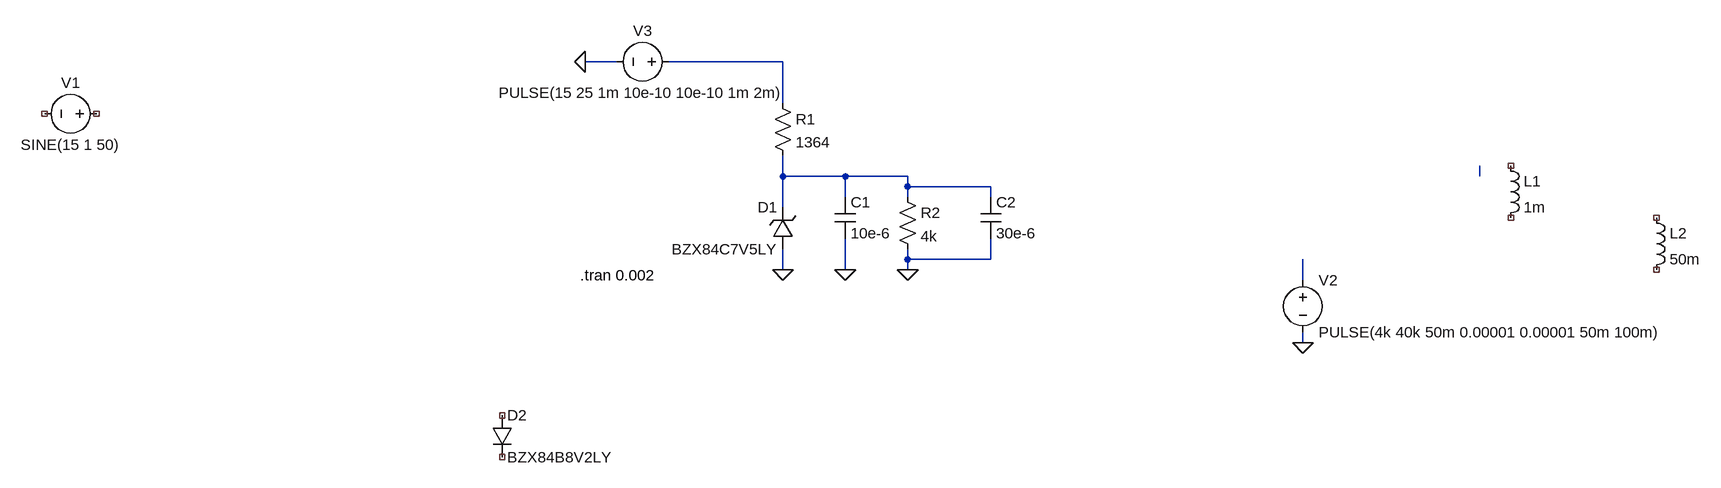
[diagram p0: schematic Draft3.asc]
Draft3.asc, the LTspice schematic file:
Version 4.1
SHEET 1 1660 688
WIRE -16 64 -64 64
WIRE 240 64 64 64
WIRE 240 128 240 64
WIRE 240 240 240 208
WIRE 336 240 240 240
WIRE 432 240 336 240
WIRE 1312 240 1312 224
WIRE 432 256 432 240
WIRE 560 256 432 256
WIRE 336 272 336 240
WIRE 432 272 432 256
WIRE 560 272 560 256
WIRE 240 288 240 240
WIRE 432 368 432 352
WIRE 560 368 560 336
WIRE 560 368 432 368
WIRE 240 384 240 352
WIRE 336 384 336 336
WIRE 432 384 432 368
WIRE 1040 400 1040 368
WIRE 1040 496 1040 480
FLAG 240 384 0
FLAG 336 384 0
FLAG -64 64 0
FLAG 1040 496 0
FLAG 432 384 0
SYMBOL voltage -800 144 R90
WINDOW 0 -32 56 VBottom 2
WINDOW 3 32 56 VTop 2
SYMATTR InstName V1
SYMATTR Value SINE(15 1 50)
SYMBOL res 224 112 R0
SYMATTR InstName R1
SYMATTR Value 1364
SYMBOL res 416 256 R0
SYMATTR InstName R2
SYMATTR Value 4k
SYMBOL cap 320 272 R0
SYMATTR InstName C1
SYMATTR Value 10e-6
SYMBOL zener 256 352 R180
WINDOW 0 24 64 Left 2
WINDOW 3 24 0 Left 2
SYMATTR InstName D1
SYMATTR Value BZX84C7V5LY
SYMBOL voltage 1040 384 R0
SYMATTR InstName V2
SYMATTR Value PULSE(4k 40k 50m 0.00001 0.00001 50m 100m)
SYMBOL voltage 80 64 R90
WINDOW 0 -32 56 VBottom 2
WINDOW 3 32 56 VTop 2
SYMATTR InstName V3
SYMATTR Value PULSE(15 25 1m 10e-10 10e-10 1m 2m)
SYMBOL cap 544 272 R0
SYMATTR InstName C2
SYMATTR Value 30e-6
SYMBOL ind 1344 208 R0
SYMATTR InstName L1
SYMATTR Value 1m
SYMBOL diode -208 608 R0
SYMATTR InstName D2
SYMATTR Value BZX84B8V2LY
SYMBOL ind 1568 288 R0
SYMATTR InstName L2
SYMATTR Value 50m
TEXT -72 392 Left 2 !.tran 0.002

The netlist it stands for:
* Draft3.asc
V1 NC_01 NC_02 SINE(15 1 50)
R1 N001 N002 1364
R2 N002 0 4k
C1 N002 0 10e-6
D1 0 N002 BZX84C7V5LY
V2 N004 0 PULSE(4k 40k 50m 0.00001 0.00001 50m 100m)
V3 N001 0 PULSE(15 25 1m 10e-10 10e-10 1m 2m)
C2 N002 0 30e-6
L1 NC_03 NC_04 1m
D2 NC_05 NC_06 BZX84B8V2LY
L2 NC_07 NC_08 50m
.model D D
.lib standard.dio
.tran 0.002
.backanno
.end